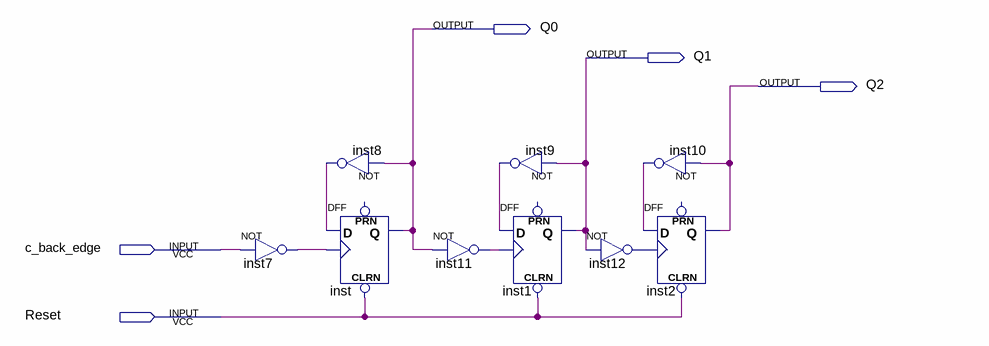
[diagram p0: schematic sheet]
// Quartus schematic ACNT.bdf as structural Verilog: 9 symbols, 5 pins
module ACNT (
  input  c_back_edge,
  input  Reset,
  output Q0,
  output Q1,
  output Q2
);

  wire inst7_out, inst8_out, inst9_out, inst10_out, inst11_out, inst12_out;

  not inst7 (inst7_out, c_back_edge);
  not inst8 (inst8_out, Q0);
  DFF inst (.CLRN(Reset), .CLK(inst7_out), .D(inst8_out), .Q(Q0));  // open: PRN
  not inst11 (inst11_out, Q0);
  not inst9 (inst9_out, Q1);
  DFF inst1 (.CLRN(Reset), .CLK(inst11_out), .D(inst9_out), .Q(Q1));  // open: PRN
  not inst12 (inst12_out, Q1);
  not inst10 (inst10_out, Q2);
  DFF inst2 (.CLRN(Reset), .CLK(inst12_out), .D(inst10_out), .Q(Q2));  // open: PRN
endmodule
